# EAGLE design ttp223 (EAGLE 7.6.0)
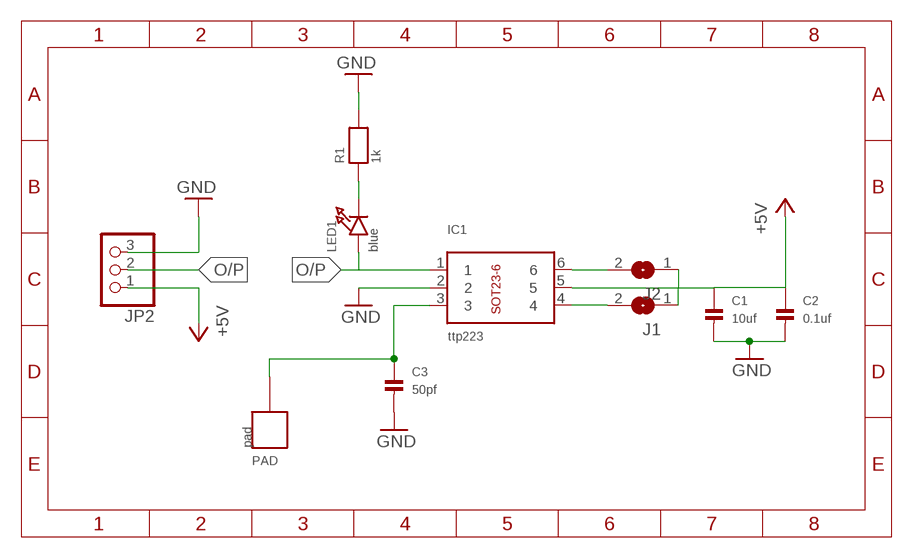
[diagram p0: schematic, sheet 1]

## Parts
C1  10uf  CAP_CERAMIC0805  [0805]
C2  0.1uf  CAP_CERAMIC0805  [0805]
C3  50pf  CAP_CERAMIC0805  [0805]
IC1  ttp223  BREAKOUT_SOT23-6  [BREAKOUT_SOT23-6]
J1  SOLDERJUMPERREFLOW  [SOLDERJUMPER_REFLOW]
J2  SOLDERJUMPERREFLOW  [SOLDERJUMPER_REFLOW]
JP2  HEADER-1X3ROUND  [1X03_ROUND]
LED1  blue  LED0805  [CHIPLED_0805]
PAD  pad  CAP_TOUCHPAD  [CAP_TOUCHPAD]
R1  1k  RESISTOR0805  [0805]

## Nets
+5V: C1.1 C2.1 IC1.5 J1.1 J2.1 JP2.1
GND: C1.2 C2.2 C3.2 IC1.2 JP2.3 R1.2
N$1: LED1.C R1.1
N$3: C3.1 IC1.3 PAD.P$1
N$5: IC1.6 J2.2
N$6: IC1.4 J1.2
O/P: IC1.1 JP2.2 LED1.A

## Library data of the parts
C1-C3 = microbuilder:CAP_CERAMIC: Ceramic Capacitors 0402 - 0402 Surface Mount Capacitors 16pF 50V 5% [Digikey: 445-4899-2-ND] 18pF 50V 5% [Digikey: 490-1281-2-ND] 22pF 50V 5% [Digikey: 490-1283-2-ND] 68pF 50V 5% [Digikey: 490-1289-2-ND] 0.1uF 10V 10% [Digikey: 490-1318-2-ND] 1.0uF 6.3V 10% [Digikey: 490-1320-2-ND] 0603 - 0603 Surface Mount Capacitors 16 pF 50V 5% [Digikey: 445-5051-2-ND] 22 pF 50V [Digikey: PCC220ACVTR-ND] 33 pF 50V 5% [Digikey: 490-1415-1-ND] 56pF 50V 5% [Digikey: 490-1421-1-ND] 220pF 50V 5% [Digikey: 445-1285-1-ND] 680 pF 50V 2200 pF 50V 5% C0G [Digikey: 445-1297-1-ND] 5600 pF 100V 5% X7R [Digikey: 478-3711-1-ND] 0.1 µF 25V 10% [Digikey: PCC2277TR-ND] 0.22 µF 16V 10% X7R [Digikey: 445-1318-1-ND] 1.0 µF 25V 10% [Digikey: 445-5146-2-ND] 0603 - RF Specific 3pF 250V +/-0.1pF RF [Digikey: 712-1347-1-ND] 18 pF 250V 5% [Digikey: 478-3505-1-ND or 712-1322-1-ND] 56 pF 250V 5% C0G RF [Digikey: 490-4867-1-ND] 68 pF 250V RF [Digikey: 490-4868-1-ND] 0805 - 0805 Surface Mount Capacitors 220 pF 250V 2% RF Ceramic Capacitor [Digikey: 712-1398-1-ND] 1000 pF 50V 2% NP0 Ceramic Capacitor [Digikey: 478-3760-1-ND] 0.1 µF 25V 10% Ceramic Capacitor [Digikey: PCC1828TR-ND] 1.0 µF 16V 10% Ceramic Capacitor[Digikey: 490-1691-2-ND] 10.0 µF 10V 10% Ceramic Capacitor[Digikey: 709-1228-1-ND] 10.0 uF 16V 10% Ceramic Capacitor [Digikey: 478-5165-2-ND] 47 uF 6.3V 20% Ceramic Capacitor [Digikey: 587-1779-1-ND or 399-5506-1-ND] 1206 - 1206 Surface Mount Capacitors 47uF 10V 20% Ceramic Capacitor [Digikey: 490-5528-1-ND or 399-5508-1-ND or 445-6010-1-ND] 100uF 6.3V -20%, +80% Y5V Ceramic Capacitor (Digikey: 490-4512-1-ND, Mouser: 81-GRM31CF50J107ZE1L)
IC1 = microbuilder:BREAKOUT_SOT23-6: IC Breakout SOT23-6
J1 J2 = microbuilder:SOLDERJUMPER: SMD Solder JUMPER Solder the two pads together to create a connection, or remove the solder to break it. REFLOW - Use this footprint for solder paste and reflow ovens. WAVE - Use this footprint for hand-soldering (larger pads). CLOSED - Has a trace between the two pads to ensure it is closed by default. The trace needs to be cut to disable the jumper, and can be closed again by creating a solder bridge between the two pads.
JP2 = microbuilder:HEADER-1X3: PIN HEADER
LED1 = microbuilder:LED: LED 0603 - 0603 Surface Mount Package 2mA: Green LED - Low Power (3.9mcd, 2ma, 1.7Vf) - Digikey: 475-2709-2-ND Orange LED - Low Power (9.8mcd, 2ma, 1.8Vf) - Digikey: 475-1194-2-ND Red LED - Low Power (5mcd, 2ma, 1.8Vf) - Digikey: 475-1195-2-ND Yellow LED - Low Power (7mcd, 2ma, 1.8Vf) - Digikey: 475-1196-2-ND 5mA: Blue LED - Low Power (17mcd, 5ma, 2.9Vf) - Digikey: LNJ937W8CRACT-ND 0805 - 0805 Surface Mount Package 2mA: Red LED (8.8mcd, 2mA, 1.8Vf, Clear) - Low Power [Digikey: 475-2510-1-ND] Green LED (5mcd, 2mA, 1.8Vf, Clear) - Low Power [Digikey: 475-2730-1-ND] Yellow LED (11.3mcd, 2mA, 1.8Vf, Clear) - Low Power [Digikey: 475-2555-1-ND] 20mA: Red LED (104mcd, 20mA, Diffused) - LS R976 [Digikey: 475-1278-6-ND] Red LED (12mcd, 20mA, 2.0Vf, Clear) - APT2012EC [Digikey: 754-1128-1-ND] Green LED (15mcd, 20mA, 2.2Vf, Clear) - APT2012GC [Digikey: 754-1131-1-ND] Orange LED (160mcd, 20mA, 2.1Vf, Clear) - APT2012SECK [Digikey: 754-1130-1-ND] 1206 - 1206 Surface Mount Package Green LED (26mcd, 20mA, Diffused) - LG N971 [Digikey: 475-1407-6-ND] Red LED (15mcd, 20mA, Diffused) - LH N974 [Digikey: 475-1416-6-ND]
PAD = Alfred:CAP_TOUCHPAD
R1 = microbuilder:RESISTOR: Resistors 0402 - 0402 Surface Mount Package 22 Ohm 1% 1/16W [Digikey: 311-22.0LRTR-ND] 33 Ohm 5% 1/16W 1.0K 5% 1/16W 1.5K 5% 1/16W 2.0K 1% 1/16W 10.0K 1% 1/16W [Digikey: 311-10.0KLRTR-ND] 10.0K 5% 1/16W [Digikey: RMCF0402JT10K0TR-ND] 12.1K 1% 1/16W [Digikey: 311-22.0LRTR-ND] 100.0K 5% 1/16W 0603 - 0603 Surface Mount Package 0 Ohm 1/10 Watt 1% Resistor 15 Ohm 1/10 Watt 1% Resistor 33 Ohm 1/10 Watt 1% Resistor 49.9 Ohm 1/10 Watt 1% Resistor 100 Ohm 1/10 Watt 1% Resistor 150 Ohm 1/10 Watt 1% Resistor 240 Ohm 1/10 Watt 1% Resistor 390 Ohm 1/10 Watt 1% Resistor 560 Ohm 1/10 Watt 1% Resistor 680 Ohm 1/10 Watt 1% Resistor 750 Ohm 1/10 Watt 1% Resistor 1.0K Ohm 1/10 Watt 1% Resistor 1.5K Ohm 1/10 Watt 1% Resistor 2.0K Ohm 1/10 Watt 1% Resistor 2.2K Ohm 1/10 Watt 1% Resistor 3.3K Ohm 1/10 Watt 1% Resistor 4.7K Ohm 1/10 Watt 1% Resistor 10.0K Ohm 1/10 Watt 1% Resistor 12.0K Ohm 1/10 Watt 1% Resistor 12.1K Ohm 1/10 Watt 1% Resistor 20.0K Ohm 1/10 Watt 1% Resistor 33.0K Ohm 1/10 Watt 1% Resistor 100.0K Ohm 1/10 Watt 1% Resistor 0805 - 0805 Surface Mount Package 0 Ohm 1/8 Watt 1% Resistor 33 Ohm 1/8 Watt 1% Resistor 100 Ohm 1/8 Watt 1% Resistor 150 Ohm 1/8 Watt 1% Resistor 200 Ohm 1/8 Watt 1% Resistor 240 Ohm 1/8 Watt 1% Resistor 330 Ohm 1/8 Watt 1% Resistor 390 Ohm 1/8 Watt 1% Resistor 470 Ohm 1/8 Watt 1% Resistor 1.0K Ohm 1/8 Watt 1% Resistor 1.5K Ohm 1/8 Watt 1% Resistor 2.0K Ohm 1/8 Watt 1% Resistor 4.7K Ohm 1/8 Watt 1% Resistor 5.1K Ohm 1/8 Watt 1% Resistor 5.6K Ohm 1/8 Watt 1% Resistor 10.0K Ohm 1/8 Watt 1% Resistor 22.0K Ohm 1/8 Watt 1% Resistor 33.0K Ohm 1/8 Watt 1% Resistor 100K Ohm 1/8 Watt 1% Resistor 1206 - 1206 Surface Mount Package 2012 - 2010 Surface Mount Package 0.11 Ohm 1/2 Watt 1% Resistor - Digikey: RHM.11UCT-ND

## Board
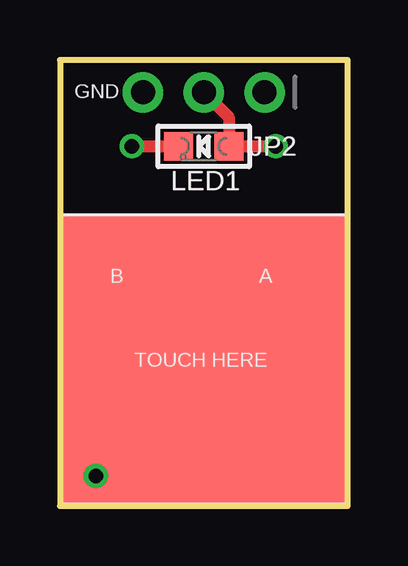
[diagram p1: board, top side]
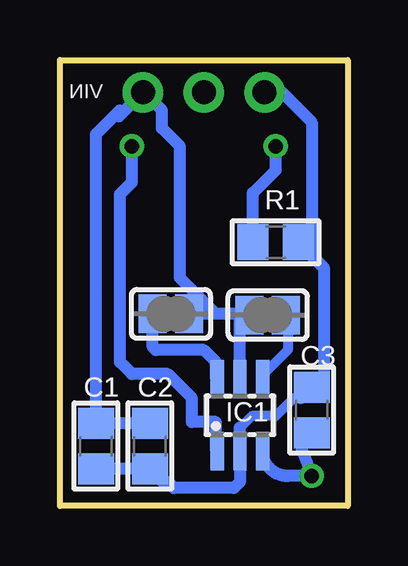
[diagram p2: board, bottom side, seen from below]

Size 12 x 18.6 mm. Coordinates in mm from the lower left corner, seen from the top.
Outline: 0,0 12,0 12,18.6 0,18.6 0,0
Copper layers (1*16): Top 0.035mm / dielectric 0.5mm / Bottom 0.035mm
Design rules "default *": minimum track width 12mil, minimum drill 10mil, track to track 15mil, track to pad 12mil, pad to pad 15mil, via to via 15mil, smd to smd 15mil, copper to edge 0.5mm, drill to drill 15mil, minimum pad ring 10mil, minimum via ring 8mil, stop-mask expansion 4mil, vias tented up to drill 0mil, thermal gap 10mil

### Footprints (pad centres in the part's own frame; a part is rotated, then mirrored left to right if it is on the bottom)
0805 = smd 1.3 x 1.5: 1 -0.95,0; 2 0.95,0
BREAKOUT_SOT23-6 = smd 0.55 x 1.6: 1 -0.95,-1.5; 2 0,-1.5; 3 0.95,-1.5; 4 0.95,1.5; 5 0,1.5; 6 -0.95,1.5
SOLDERJUMPER_REFLOW = smd 1.168 x 1.6: 1 -0.762,0; 2 0.762,0
1X03_ROUND = drill 1 pad 1.676: 1 -2.54,0; 2 0,0; 3 2.54,0
CHIPLED_0805 = smd 1.2 x 1.2: A 0,-1.05; C 0,1.05
CAP_TOUCHPAD = smd 12 x 12: P$1 0,0

### Placement (x,y rotation side)
C1  10.5,2.5 270 bottom
C2  8.25,2.5 270 bottom
C3  1.5,4 90 bottom
IC1  4.49,3.78 0 bottom
J1  3.33,7.96 0 bottom
J2  7.37,8.01 180 bottom
JP2  6,17.25 180 top
LED1  6,15 90 top
PAD  6,6.12 0 top
R1  3,11 0 bottom

### Tracks (layer width: path | path; a pad name or v marks a point on that pad's centre or on a via)
+5V
  Bottom 0.5: 5.5,8.01 4.14,8.01 J1.1 4.46,7.96 4.5,8 IC1.5 | 5.5,8.01 J2.1 | C1.1 10.5,4 | 10.5,4 10.5,15.5 9.75,16.25 | 9.5,16.5 9.75,16.25 | C2.1 9.95,3.45 10.5,4 | 9.75,16.25 9.54,16.25 JP2.1 8.5,17.25 7.75,16.5 7.75,15.75 7,15 7,9.51 5.5,8.01
GND
  Bottom 0.406: 7.7,1 C2.2 | 4.5,3.26 4.49,3.26 4,3.75 3,3.75 2.25,4.5 1.95,4.5
  Bottom 0.5: R1.2 1.52,10.47 | 1.52,10.47 1,9.95 1,5 C3.2 1.95,4.5 | 4.49,3.26 IC1.2 4.5,1 4.75,0.75 7.25,0.75 7.5,1 7.7,1 | 1.52,10.47 1.5,10.5 1.5,16 2.75,17.25 JP2.3 | 8,1.5 C2.2 C1.2
N$1  (via drill 0.6)
  Top 0.5: v3,15 LED1.C
  Bottom 0.5: R1.1 3.95,13.05 3,14 v3,15
N$3  (via drill 0.6)
  Top 0.61: v1.5,1.25 3.25,2.5 3.5,2.5 6,5 PAD.P$1
  Bottom 0.5: C3.1 2,2.55 v1.5,1.25 2.51,1.25 arc90 IC1.3
N$5
  Bottom 0.5: IC1.6 5.5,5.34 5.5,6 6,6.5 8,6.5 8.13,6.63 J2.2
N$6
  Bottom 0.406: 2.5,7.89 2.5,6.5 3.54,5.46
  Bottom 0.5: J1.2 2.5,7.89 | 3.54,5.46 IC1.4
O/P  (via drill 0.6)
  Top 0.5: v9,15 LED1.A 7.05,16.2 JP2.2
  Bottom 0.5: IC1.1 5.5,2.34 5.5,3.5 6.5,3.5 6.5,4.5 7.5,5.5 9,5.5 9.5,6 9.5,13 9,13.5 v9,15

### Text on the board
tPlace: GND | TOUCH HERE
bPlace: VIN
tNames: B | A
_tNames: JP2 | LED1
_bNames: R1 | C3 | C2 | C1 | IC1